# EAGLE design sistema min (EAGLE 7.6.0)
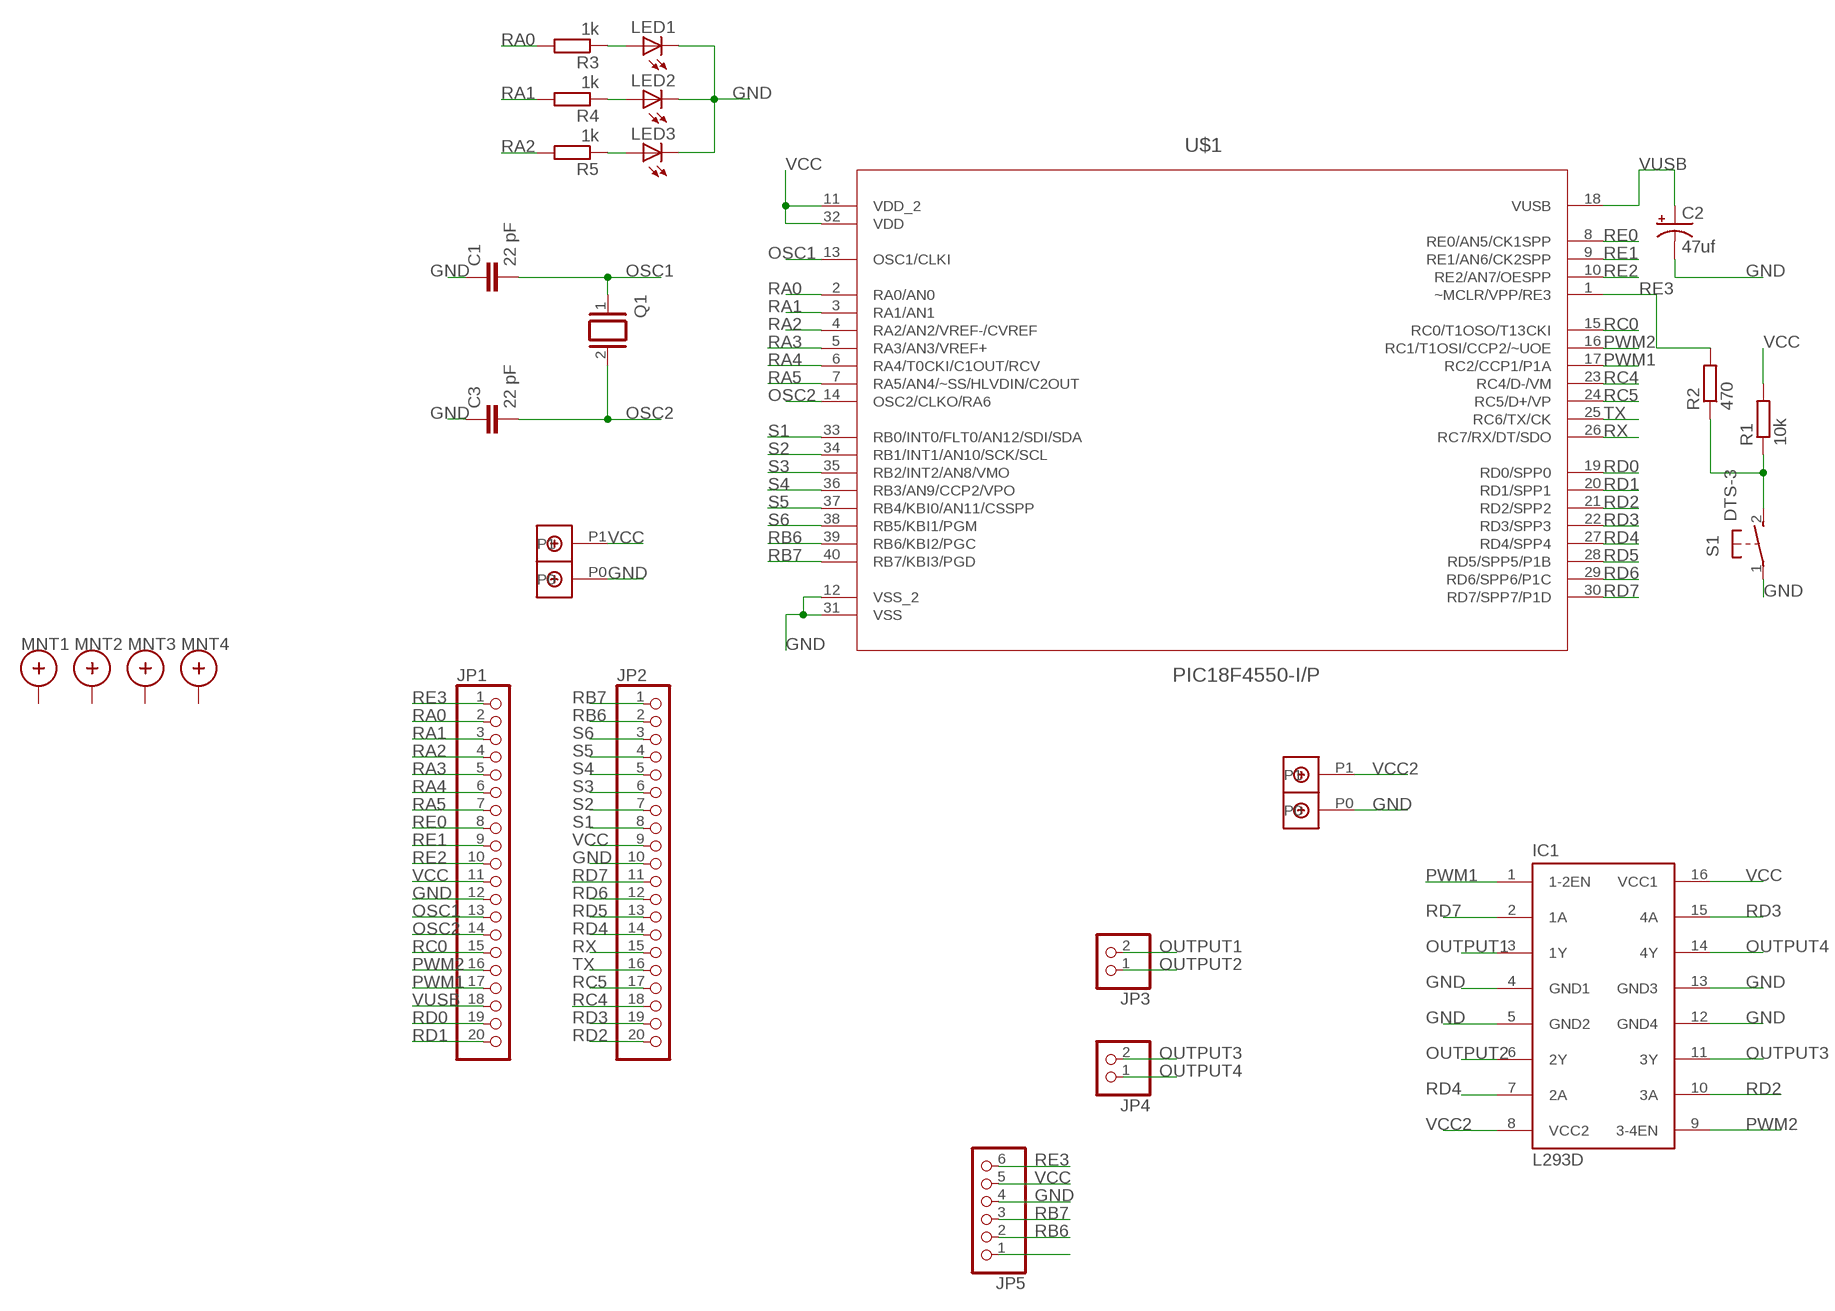
[diagram p0: schematic, sheet 1]

## Parts
C1  22 pF  C-EU050-025X075  [C050-025X075]
C2  47uf  CPOL-USE5-10.5  [E5-10,5]
C3  22 pF  C-EU050-025X075  [C050-025X075]
IC1  L293D  [DIL16]
JP1  PINHD-1X20  [1X20]
JP2  PINHD-1X20  [1X20]
JP3  PINHD-1X2  [1X02]
JP4  PINHD-1X2  [1X02]
JP5  PINHD-1X6  [1X06]
LED1  LED3MM  [LED3MM]
LED2  LED3MM  [LED3MM]
LED3  LED3MM  [LED3MM]
MNT1  HOLE_MNT_0.135  [HOLE_MNT_#5-40]
MNT2  HOLE_MNT_0.135  [HOLE_MNT_#5-40]
MNT3  HOLE_MNT_0.135  [HOLE_MNT_#5-40]
MNT4  HOLE_MNT_0.135  [HOLE_MNT_#5-40]
Q1  XTAL/S  [QS]
R1  10k  R-EU_0204/7  [0204/7]
R2  470  R-EU_0204/7  [0204/7]
R3  1k  R-EU_0204/7  [0204/7]
R4  1k  R-EU_0204/7  [0204/7]
R5  1k  R-EU_0204/7  [0204/7]
S1  DTS-3  [DTS-3]
U$1  PIC18F4550-I/P  [DIP254P1524X635-40]
U$2  DBCONN-1X2  [DBCONN-1X2]
U$3  DBCONN-1X2  [DBCONN-1X2]

## Nets
GND: C1.1 C2.- C3.1 IC1.4(GND1) IC1.5(GND2) IC1.12(GND4) IC1.13(GND3) JP1.12 JP2.10 JP5.4 LED1.K(C) LED2.K(C) LED3.K(C) S1.1 U$1.12(VSS_2) U$1.31(VSS) U$2.P0 U$3.P0
N$3: R1.1 R2.1 S1.2
N$4: LED1.A R3.1
N$6: LED2.A R4.1
N$7: LED3.A R5.1
N$10: JP5.1
OSC1: C1.2 JP1.13 Q1.1 U$1.13(OSC1/CLKI)
OSC2: C3.2 JP1.14 Q1.2 U$1.14(OSC2/CLKO/RA6)
OUTPUT1: IC1.3(1Y) JP3.2
OUTPUT2: IC1.6(2Y) JP3.1
OUTPUT3: IC1.11(3Y) JP4.2
OUTPUT4: IC1.14(4Y) JP4.1
PWM1: IC1.1(1-2EN) JP1.17 U$1.17(RC2/CCP1/P1A)
PWM2: IC1.9(3-4EN) JP1.16 U$1.16(RC1/T1OSI/CCP2/~UOE)
RA0: JP1.2 R3.2 U$1.2(RA0/AN0)
RA1: JP1.3 R4.2 U$1.3(RA1/AN1)
RA2: JP1.4 R5.2 U$1.4(RA2/AN2/VREF-/CVREF)
RA3: JP1.5 U$1.5(RA3/AN3/VREF+)
RA4: JP1.6 U$1.6(RA4/T0CKI/C1OUT/RCV)
RA5: JP1.7 U$1.7(RA5/AN4/~SS/HLVDIN/C2OUT)
RB6: JP2.2 JP5.2 U$1.39(RB6/KBI2/PGC)
RB7: JP2.1 JP5.3 U$1.40(RB7/KBI3/PGD)
RC0: JP1.15 U$1.15(RC0/T1OSO/T13CKI)
RC4: JP2.18 U$1.23(RC4/D-/VM)
RC5: JP2.17 U$1.24(RC5/D+/VP)
RD0: JP1.19 U$1.19(RD0/SPP0)
RD1: JP1.20 U$1.20(RD1/SPP1)
RD2: IC1.10(3A) JP2.20 U$1.21(RD2/SPP2)
RD3: IC1.15(4A) JP2.19 U$1.22(RD3/SPP3)
RD4: IC1.7(2A) JP2.14 U$1.27(RD4/SPP4)
RD5: JP2.13 U$1.28(RD5/SPP5/P1B)
RD6: JP2.12 U$1.29(RD6/SPP6/P1C)
RD7: IC1.2(1A) JP2.11 U$1.30(RD7/SPP7/P1D)
RE0: JP1.8 U$1.8(RE0/AN5/CK1SPP)
RE1: JP1.9 U$1.9(RE1/AN6/CK2SPP)
RE2: JP1.10 U$1.10(RE2/AN7/OESPP)
RE3: JP1.1 JP5.6 R2.2 U$1.1(~MCLR/VPP/RE3)
RX: JP2.15 U$1.26(RC7/RX/DT/SDO)
S1: JP2.8 U$1.33(RB0/INT0/FLT0/AN12/SDI/SDA)
S2: JP2.7 U$1.34(RB1/INT1/AN10/SCK/SCL)
S3: JP2.6 U$1.35(RB2/INT2/AN8/VMO)
S4: JP2.5 U$1.36(RB3/AN9/CCP2/VPO)
S5: JP2.4 U$1.37(RB4/KBI0/AN11/CSSPP)
S6: JP2.3 U$1.38(RB5/KBI1/PGM)
TX: JP2.16 U$1.25(RC6/TX/CK)
VCC: IC1.16(VCC1) JP1.11 JP2.9 JP5.5 R1.2 U$1.11(VDD_2) U$1.32(VDD) U$2.P1
VCC2: IC1.8(VCC2) U$3.P1
VUSB: C2.+ JP1.18 U$1.18(VUSB)
Unconnected: MNT1.P$1 MNT2.P$1 MNT3.P$1 MNT4.P$1

## Library data of the parts
C1 C3 = rcl:C-EU: CAPACITOR, European symbol
C2 = rcl:CPOL-US: POLARIZED CAPACITOR, American symbol
IC1 = st-microelectronics:L293D: PUSH-PULL 4 CHANNEL DRIVER; MPN: L293D; OC_FARNELL: 9589619; OC_NEWARK: 56P8249
JP1 JP2 = pinhead:PINHD-1X20: PIN HEADER
JP3 JP4 = pinhead:PINHD-1X2: PIN HEADER
JP5 = pinhead:PINHD-1X6: PIN HEADER
LED1-LED3 = led:LED: LED OSRAM: - CHIPLED LG R971, LG N971, LY N971, LG Q971, LY Q971, LO R971, LY R971 LH N974, LH R974 LS Q976, LO Q976, LY Q976 LO Q996 - Hyper CHIPLED LW Q18S LB Q993, LB Q99A, LB R99A - SideLED LS A670, LO A670, LY A670, LG A670, LP A670 LB A673, LV A673, LT A673, LW A673 LH A674 LY A675 LS A676, LA A676, LO A676, LY A676, LW A676 LS A679, LY A679, LG A679 - Hyper Micro SIDELED® LS Y876, LA Y876, LO Y876, LY Y876 LT Y87S - SmartLED LW L88C, LW L88S LB L89C, LB L89S, LG L890 LS L89K, LO L89K, LY L89K LS L896, LA L896, LO L896, LY L896 - TOPLED LS T670, LO T670, LY T670, LG T670, LP T670 LSG T670, LSP T670, LSY T670, LOP T670, LYG T670 LG T671, LOG T671, LSG T671 LB T673, LV T673, LT T673, LW T673 LH T674 LS T676, LA T676, LO T676, LY T676, LB T676, LH T676, LSB T676, LW T676 LB T67C, LV T67C, LT T67C, LS T67K, LO T67K, LY T67K, LW E67C LS E67B, LA E67B, LO E67B, LY E67B, LB E67C, LV E67C, LT E67C LW T67C LS T679, LY T679, LG T679 LS T770, LO T770, LY T770, LG T770, LP T770 LB T773, LV T773, LT T773, LW T773 LH T774 LS E675, LA E675, LY E675, LS T675 LS T776, LA T776, LO T776, LY T776, LB T776 LHGB T686 LT T68C, LB T68C - Hyper Mini TOPLED® LB M676 - Mini TOPLED Santana® LG M470 LS M47K, LO M47K, LY M47K Source: http://www.osram.convergy.de LUXEON: - LUMILED® LXK2-PW12-R00, LXK2-PW12-S00, LXK2-PW14-U00, LXK2-PW14-V00 LXK2-PM12-R00, LXK2-PM12-S00, LXK2-PM14-U00 LXK2-PE12-Q00, LXK2-PE12-R00, LXK2-PE12-S00, LXK2-PE14-T00, LXK2-PE14-U00 LXK2-PB12-K00, LXK2-PB12-L00, LXK2-PB12-M00, LXK2-PB14-N00, LXK2-PB14-P00, LXK2-PB14-Q00 LXK2-PR12-L00, LXK2-PR12-M00, LXK2-PR14-Q00, LXK2-PR14-R00 LXK2-PD12-Q00, LXK2-PD12-R00, LXK2-PD12-S00 LXK2-PH12-R00, LXK2-PH12-S00 LXK2-PL12-P00, LXK2-PL12-Q00, LXK2-PL12-R00 Source: www.luxeon.com KINGBRIGHT: KA-3528ASYC Source: www.kingbright.com
MNT1-MNT4 = Existing Library:HOLE_MNT_0.135: Mounting Hole. 0.135 plated hole created for a #5-40 screw, McMaster p/n 91772A125
Q1 = special:XTAL/S: CRYSTAL
R1-R5 = rcl:R-EU_: RESISTOR, European symbol
S1 = switch-tact:DTS-3
U$1 = Microchip_By_element14_Batch_1:PIC18F4550-I/P: USB Microcontrollers; DESCRIPTION: USB Microcontrollers; MPN: PIC18F4550-I/P; OC_FARNELL: 9321357; OC_NEWARK: 74K8623; PACKAGE: DIP-40; SUPPLIER: Microchip
U$2 U$3 = Terminal Block Connector:DBCONN-1X2

## Board
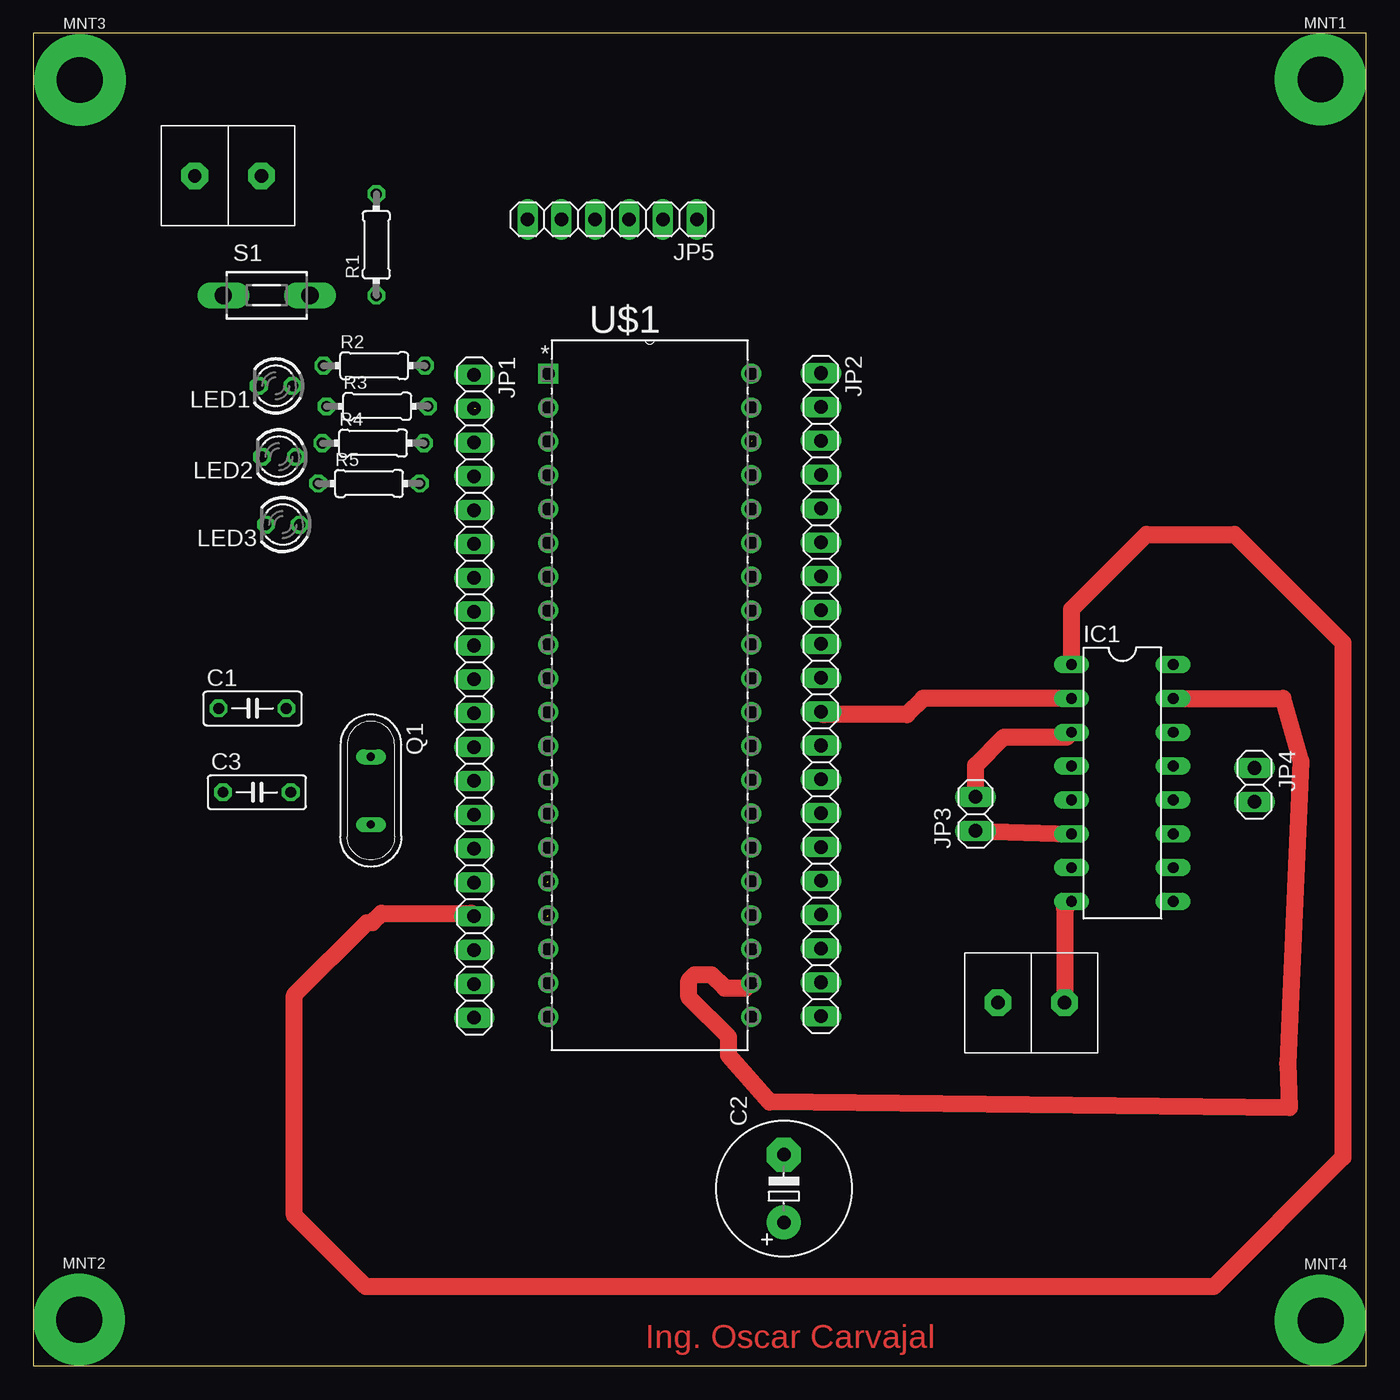
[diagram p1: board, top side]
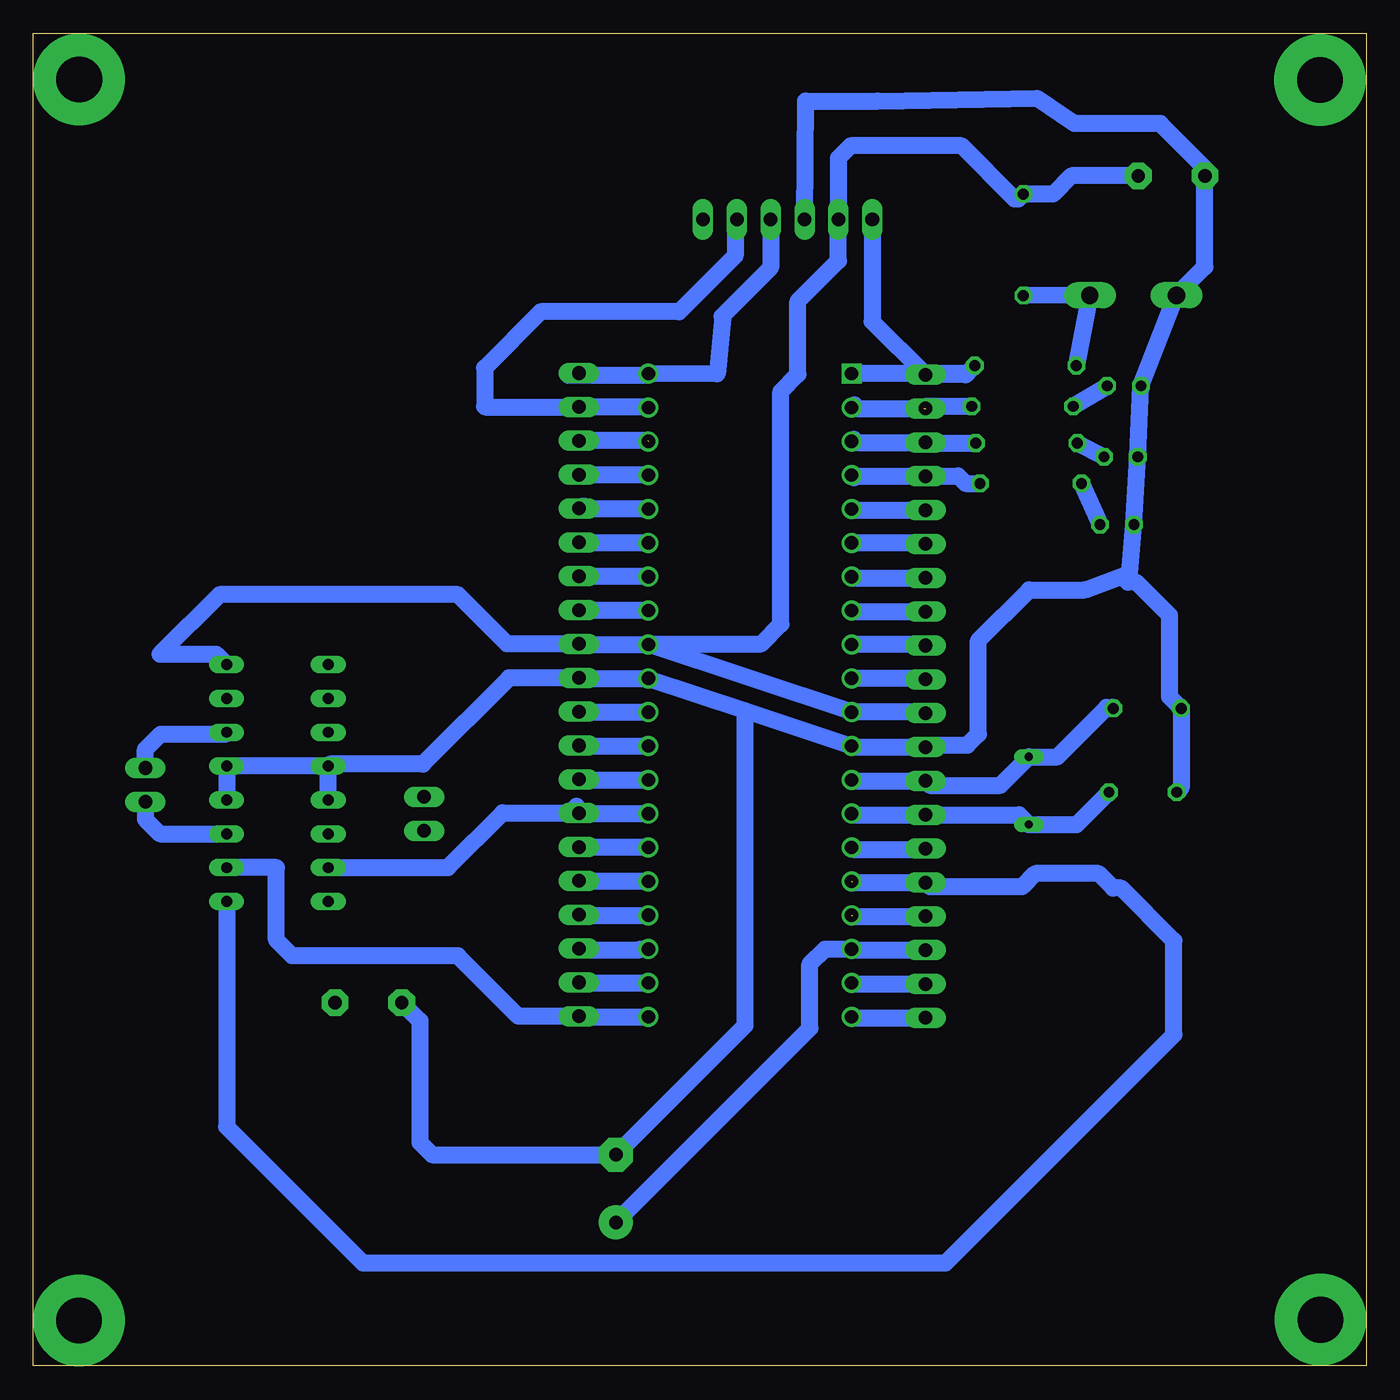
[diagram p2: board, bottom side, seen from below]

Size 100 x 100 mm. Coordinates in mm from the lower left corner, seen from the top.
Outline: 0,0 100,0 100,100 0,100 0,0
Copper layers (1*16): Top 0.035mm / dielectric 1.5mm / Bottom 0.035mm
Design rules "default": minimum track width 10mil, minimum drill 24mil, track to track 8mil, track to pad 8mil, pad to pad 8mil, via to via 8mil, smd to smd 8mil, copper to edge 40mil, drill to drill 8mil, minimum pad ring 10mil, minimum via ring 8mil, stop-mask expansion 4mil, vias tented up to drill 0mil, thermal gap 10mil

### Footprints (pad centres in the part's own frame; a part is rotated, then mirrored left to right if it is on the bottom)
C050-025X075 = drill 0.813 octagon: 1 -2.54,0; 2 2.54,0
E5-10,5 = drill 1.016 pad 2.54: + -2.54,0 | drill 1.016 pad 2.54 octagon: - 2.54,0
DIL16 = drill 0.813 long: 1 -8.89,-3.81; 2 -6.35,-3.81; 3 -3.81,-3.81; 4 -1.27,-3.81; 5 1.27,-3.81; 6 3.81,-3.81; 7 6.35,-3.81; 8 8.89,-3.81; 9 8.89,3.81; 10 6.35,3.81; 11 3.81,3.81; 12 1.27,3.81; 13 -1.27,3.81; 14 -3.81,3.81; 15 -6.35,3.81; 16 -8.89,3.81
1X20 = drill 1.016 long: 1 -24.13,0; 2 -21.59,0; 3 -19.05,0; 4 -16.51,0; 5 -13.97,0; 6 -11.43,0; 7 -8.89,0; 8 -6.35,0; 9 -3.81,0; 10 -1.27,0; 11 1.27,0; 12 3.81,0; 13 6.35,0; 14 8.89,0; 15 11.43,0; 16 13.97,0; 17 16.51,0; 18 19.05,0; 19 21.59,0; 20 24.13,0
1X02 = drill 1.016 long: 1 -1.27,0; 2 1.27,0
1X06 = drill 1.016 long: 1 -6.35,0; 2 -3.81,0; 3 -1.27,0; 4 1.27,0; 5 3.81,0; 6 6.35,0
LED3MM = drill 0.813 octagon: A -1.27,0; K 1.27,0
HOLE_MNT_#5-40 = drill 3.429 pad 6.858: P$1 0,0
QS = drill 0.61 long: 1 -2.54,0; 2 2.54,0
0204/7 = drill 0.813 octagon: 1 -3.81,0; 2 3.81,0
DTS-3 = drill 1.3 long: 1 -3.25,0; 2 3.25,0
DIP254P1524X635-40 = drill 0.991 square: 1 -15.24,48.26 | drill 0.991: 2 -15.24,45.72; 3 -15.24,43.18; 4 -15.24,40.64; 5 -15.24,38.1; 6 -15.24,35.56; 7 -15.24,33.02; 8 -15.24,30.48; 9 -15.24,27.94; 10 -15.24,25.4; 11 -15.24,22.86; 12 -15.24,20.32; 13 -15.24,17.78; 14 -15.24,15.24; 15 -15.24,12.7; 16 -15.24,10.16; 17 -15.24,7.62; 18 -15.24,5.08; 19 -15.24,2.54; 20 -15.24,0; 21 0,0; 22 0,2.54; 23 0,5.08; 24 0,7.62; 25 0,10.16; 26 0,12.7; 27 0,15.24; 28 0,17.78; 29 0,20.32; 30 0,22.86; 31 0,25.4; 32 0,27.94; 33 0,30.48; 34 0,33.02; 35 0,35.56; 36 0,38.1; 37 0,40.64; 38 0,43.18; 39 0,45.72; 40 0,48.26
DBCONN-1X2 = drill 1 pad 2 octagon: P0 -2.54,0; P1 2.46,0

### Placement (x,y rotation side)
C1  16.44,49.34 0 top
C2  56.3,13.31 90 top
C3  16.77,43.05 0 top
IC1  81.69,43.74 270 top
JP1  33.07,50.25 270 top
JP2  59.08,50.37 270 top
JP3  70.68,41.43 90 top
JP4  91.6,43.6 270 top
JP5  43.42,86.04 180 top
LED1  18.18,73.54 180 top
LED2  18.42,68.22 180 top
LED3  18.71,63.13 180 top
MNT1  96.56,96.54 0 top
MNT2  3.44,3.47 0 top
MNT3  3.49,96.5 0 top
MNT4  96.57,3.41 0 top
Q1  25.32,43.17 270 top
R1  25.73,84.13 90 top
R2  25.57,75.06 0 top
R3  25.8,72.01 0 top
R4  25.49,69.25 0 top
R5  25.18,66.22 0 top
S1  17.5,80.34 0 top
U$1  53.86,26.2 0 top
U$2  14.65,89.31 0 top
U$3  74.9,27.26 0 top

### Tracks (layer width: path | path; a pad name or v marks a point on that pad's centre or on a via)
GND
  Bottom 1.27: 46.61,49.18 U$1.31 59.04,51.6 JP2.10 64.3,51.64 70.78,45.16 77.73,45.16 IC1.4 | 46.61,49.18 U$1.12 38.54,46.44 JP1.12 32.92,46.59 29.93,46.59 29.1,47.42 29.1,54.43 25.3,58.23 21.14,58.23 18.13,59.34 | 18.13,59.34 17.76,59.48 LED3.K LED2.K LED1.K S1.1 12.11,82.48 U$2.P0 12.11,89.87 15.46,93.22 21.9,93.22 21.98,93.3 24.71,95.12 36.67,94.92 42.07,94.92 JP5.4 | 18.13,59.34 18.13,59.07 17.88,58.82 17.28,58.82 14.79,56.33 14.79,50.23 C1.1 13.9,43.38 C3.1 | 46.61,49.18 46.61,25.54 C2.- 70.09,15.85 71,16.76 71,25.9 U$3.P0 | IC1.4 IC1.13 IC1.12 | IC1.5 IC1.4
N$3
  Bottom 1.016: R1.1 25.62,80.43
  Bottom 1.27: R1.1 S1.2 R2.1
N$4
  Bottom 1.27: R3.1 LED1.A
N$6
  Bottom 1.27: R4.1 LED2.A
N$7
  Bottom 1.27: R5.1 LED3.A
OSC1
  Bottom 1.27: U$1.13 38.54,43.9 JP1.13 32.74,43.57 27.46,43.57 Q1.1 23.19,45.71 19.49,49.41 19.05,49.41 C1.2
OSC2
  Bottom 1.27: U$1.14 38.54,41.36 JP1.14 26.05,41.36 Q1.2 21.73,40.63 C3.2
OUTPUT1
  Top 1.27: JP3.2 70.68,45.06 72.81,47.19 77.52,47.19 IC1.3
OUTPUT2
  Top 1.27: JP3.1 IC1.6
OUTPUT3
  Bottom 1.27: JP4.2 91.6,41.02 90.5,39.92 IC1.11
OUTPUT4
  Bottom 1.27: JP4.1 91.6,46.26 90.44,47.42 85.63,47.42 IC1.14
PWM1  (1 unrouted)
  Top 1.27: IC1.1 77.88,56.78 83.5,62.4 90.12,62.4 98.24,54.28 98.24,15.64 88.54,5.94 24.94,5.94 19.59,11.29 19.59,27.84 25.03,33.28 25.43,33.28 26.12,33.97 32.84,33.97 JP1.17
  Bottom 1.27: 38.54,33.74 JP1.17
PWM2  (1 unrouted)
  Bottom 1.27: 38.54,36.28 JP1.16 32.74,35.95 25.82,35.95 24.83,36.94 20.08,36.94 19,35.86 18.4,35.86 14.44,31.9 14.44,24.86 31.57,7.73 75.28,7.73 85.5,17.95 IC1.9
RA0  (1 unrouted)
  Bottom 1.016: U$1.2 38.41,72.13
  Bottom 1.27: 38.41,72.13 38.1,71.82 33.19,71.82 33,72.01 R3.2
RA1
  Bottom 1.016: U$1.3 38.45,69.55
  Bottom 1.27: 38.45,69.55 38.2,69.3 JP1.3 33.02,69.25 R4.2
RA2
  Bottom 1.016: U$1.4 38.42,66.64
  Bottom 1.27: 38.42,66.64 38.3,66.76 JP1.4 30.62,66.78 30.06,66.22 R5.2
RA3
  Bottom 1.27: U$1.5 38.54,64.22 JP1.5
RA4
  Bottom 1.27: U$1.6 38.59,61.79 33.67,61.79 33.56,61.68 JP1.6
RA5
  Bottom 1.27: U$1.7 38.54,59.14 JP1.7
RB6
  Bottom 1.27: U$1.39 53.9,71.96 JP2.2 66.11,71.96 66.15,72 66.15,74.89 61.94,79.1 51.55,79.1 47.35,83.3 47.35,85.92 JP5.2
RB7
  Bottom 1.27: JP2.1 59.66,74.5 59.84,74.32 54,74.32 U$1.40 48.71,74.43 48.3,78.71 48.34,78.77 44.69,82.42 JP5.3
RC0
  Bottom 1.27: U$1.15 38.48,38.76 32.36,38.76 32.42,38.82 JP1.15
RC4
  Bottom 1.27: JP2.18 58.98,31.22 54.5,31.22 54.44,31.28 U$1.23
RC5
  Bottom 1.27: JP2.17 59.04,33.82 U$1.24
RD0
  Bottom 1.27: U$1.19 38.54,28.66 JP1.19
RD1
  Bottom 1.27: U$1.20 38.54,26.12 JP1.20
RD2
  Bottom 1.27: U$1.21 59.04,26.2 JP2.20 63.62,26.24 68.16,30.78 80.58,30.78 81.77,31.97 81.77,37.39 IC1.10
RD3
  Top 1.27: IC1.15 93.73,50.09 95.09,45.36 94.09,22.7 94.23,19.38 55.24,19.8 52.15,23.31 52.15,24.68 49.17,27.66 49.17,28.92 49.63,29.38 50.83,29.38 51.86,28.35 53.47,28.35 U$1.22
  Bottom 1.27: JP2.19 59.04,28.74 U$1.22
RD4
  Bottom 1.27: U$1.27 59.04,41.44 JP2.14 59.26,41.66 59.26,42 59.76,41.5 64.8,41.5 68.91,37.39 IC1.7
RD5
  Bottom 1.27: JP2.13 59.04,43.98 U$1.28
RD6
  Bottom 1.27: JP2.12 59.04,46.52 U$1.29
RD7
  Top 1.27: IC1.2 66.75,50.09 65.53,48.87 59.31,48.87 JP2.11
  Bottom 1.27: JP2.11 59.04,49.06 U$1.30
RE0
  Bottom 1.27: U$1.8 38.54,56.6 JP1.8
RE1
  Bottom 1.27: U$1.9 38.57,54.19 33.9,54.19 33.77,54.06 JP1.9
RE2
  Bottom 1.27: JP1.10 33.15,51.6 U$1.10
RE3
  Bottom 1.016: U$1.1 38.49,74.59
  Bottom 1.27: U$1.1 29.98,74.46 R2.2 30.06,74.38 JP1.1 37.07,78.38 JP5.6
RX
  Bottom 1.27: U$1.26 59.04,38.9 JP2.15
S1
  Bottom 1.27: U$1.33 59.04,56.68 JP2.8
S2
  Bottom 1.27: U$1.34 59.04,59.22 JP2.7
S3
  Bottom 1.27: U$1.35 59.04,61.76 JP2.6
S4
  Bottom 1.27: 59.04,64.3 JP2.5 58.94,64.48 58.54,64.48 58.36,64.3 U$1.36
S5
  Bottom 1.27: U$1.37 59.04,66.84 JP2.4
S6  (1 unrouted)
  Bottom 1.27: 53.9,69.42 JP2.3
TX
  Bottom 1.27: U$1.25 59.04,36.36 JP2.16
VCC
  Bottom 1.27: JP1.11 33.15,49.06 U$1.11 U$1.32 | U$1.32 59.04,54.14 JP2.9 64.46,54.18 68.16,57.88 86.03,57.88 90.5,53.41 86.28,53.41 IC1.16 | U$1.32 53.82,54.18 45.41,54.18 43.93,55.66 43.93,73.12 42.64,74.41 42.64,79.9 39.61,82.93 JP5.5 39.61,90.64 38.7,91.55 30.37,91.55 26.4,87.58 26.09,87.58 R1.2 23.51,87.94 22.14,89.31 U$2.P1
VCC2
  Top 1.27: IC1.8 77.36,34.33 U$3.P1
VUSB
  Bottom 1.27: JP1.18 38.54,31.2 U$1.18 40.61,31.28 41.74,30.15 41.74,25.33 C2.+

### Text on the board
Top: Ing. Oscar Carvajal